# Altium schematic sheet 04 - Audio.SchDoc: Audio
size A4; DrawnBy: Trevor Charmley; DocumentNumber: 6; Revision: 1; SheetNumber: 6; SheetTotal: 8
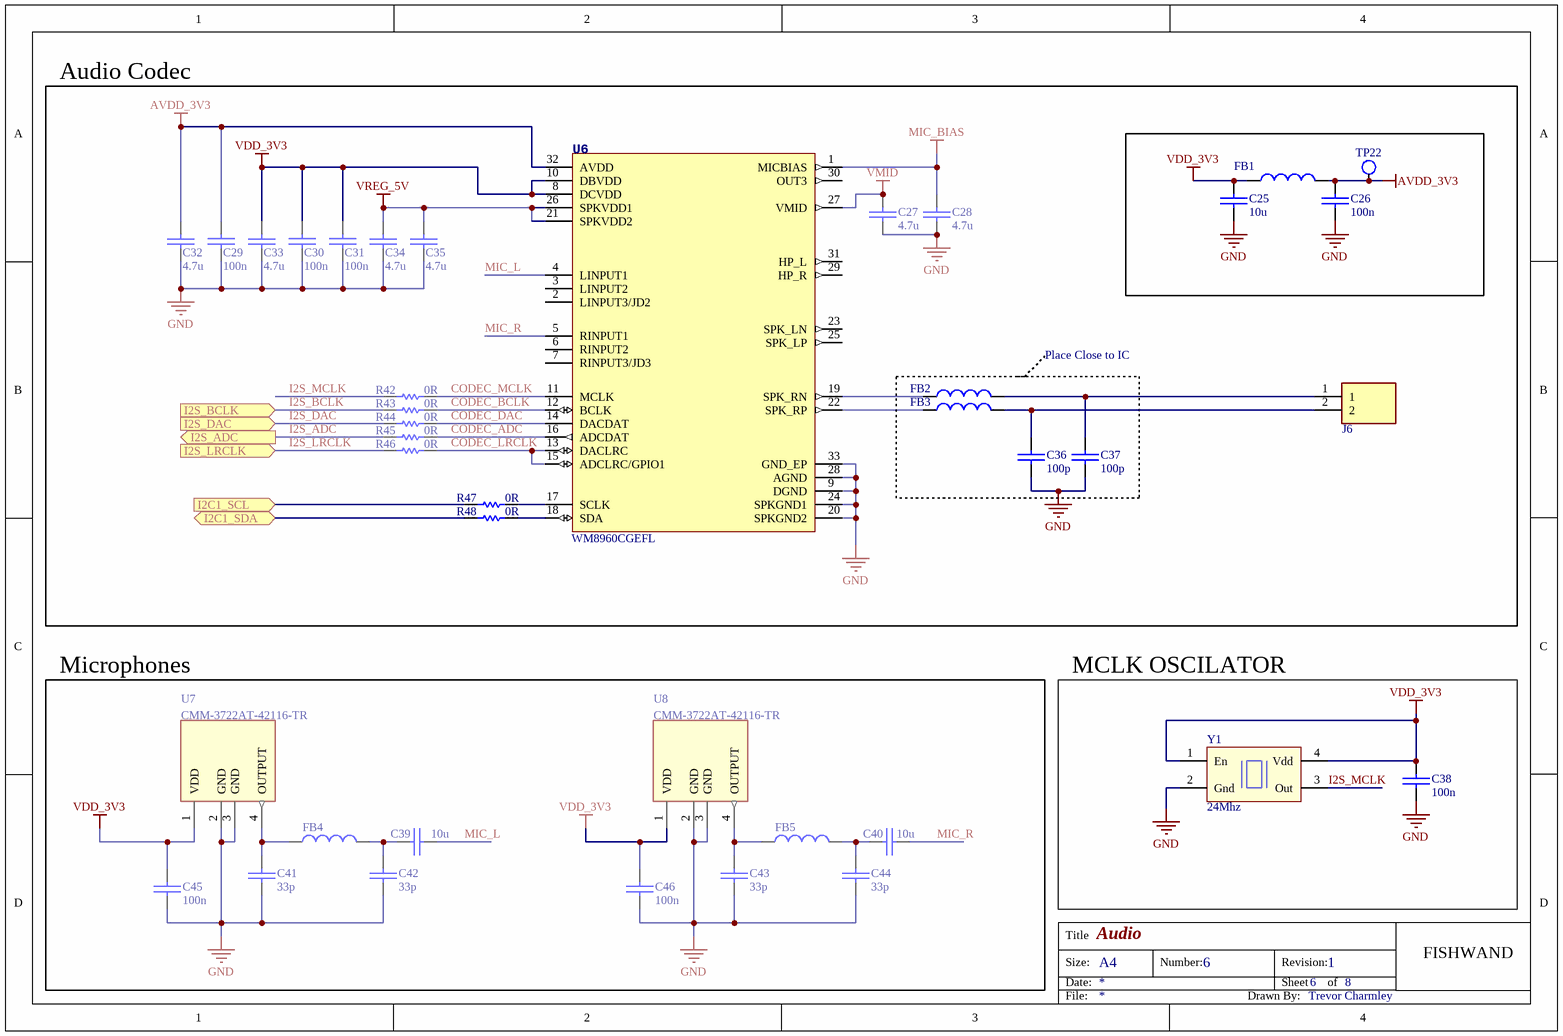
[diagram p0: 04 - Audio.SchDoc]

## Parts
C25  10u  [CAPC100X50X65]
C26  100n  [CAPC100X50X65]
C27  4.7u  [CAPC100X50X65]
C28  4.7u  [CAPC100X50X65]
C29  100n  [CAPC100X50X65]
C30  100n  [CAPC100X50X65]
C31  100n  [CAPC100X50X65]
C32  4.7u  [CAPC100X50X65]
C33  4.7u  [CAPC100X50X65]
C34  4.7u  [CAPC100X50X65]
C35  4.7u  [CAPC100X50X65]
C36  100p  [CAPC100X50X65]
C37  100p  [CAPC100X50X65]
C38  100n  [CAPC100X50X65]
C39  10u  [CAPC100X50X65]
C40  10u  [CAPC100X50X65]
C41  33p  [CAPC100X50X65]
C42  33p  [CAPC100X50X65]
C43  33p  [CAPC100X50X65]
C44  33p  [CAPC100X50X65]
C45  100n  [CAPC100X50X65]
C46  100n  [CAPC100X50X65]
FB1  BLM18RK121SN1D  [BEADC1608X95N]  (value not drawn)
FB2  BLM18RK121SN1D  [BEADC1608X95N]  (value not drawn)
FB3  BLM18RK121SN1D  [BEADC1608X95N]  (value not drawn)
FB4  BLM18BD252SN1D  [BEADC1608X95N]  (value not drawn)
FB5  BLM18BD252SN1D  [BEADC1608X95N]  (value not drawn)
J6  CONN_S2B-PH-K-S(LF)(SN)  [JST_S2B-PH-K-S(LF)(SN)]  (value not drawn)
R42  0R  [RESC0402]
R43  0R  [RESC0402]
R44  0R  [RESC0402]
R45  0R  [RESC0402]
R46  0R  [RESC0402]
R47  0R  [RESC0402]
R48  0R  [RESC0402]
TP22  Test Point  [tp_1mm]  (value not drawn)  (no BOM)
U6  WM8960CGEFL  [CIRRUS_LOGIC_WM8960CGEFL-V_0]
U7  CMM-3722AT-42116-TR  [XDCR_CMM-3722AT-42116-TR]
U8  CMM-3722AT-42116-TR  [XDCR_CMM-3722AT-42116-TR]
Y1  24Mhz  [OSC_SG-210STF 24.0000ML0]

## Blocks framed on the sheet
Audio Codec: C25-C35 FB1 J6 R42-R48 TP22 U6
Place Close to IC: C36 C37 FB2 FB3
Microphones: C39-C46 FB4 FB5 U7 U8
MCLK OSCILATOR: C38 Y1

## Ports
I2C1_SCL (in), I2C1_SDA (bidir), I2S_ADC (out), I2S_BCLK (in), I2S_DAC (in), I2S_LRCLK (in)

## Nets
AVDD_3V3: C26.1 C29.1 C32.2 FB1.2 TP22.1 U6.32(AVDD)
GND: C25.2 C26.2 C27.1 C28.1 C29.2 C30.2 C31.2 C32.1 C33.1 C34.1 C35.1 C36.2 C37.2 C38.2 C41.1 C42.1 C43.1 C44.1 C45.2 C46.2 U6.9(DGND) U6.20(SPKGND2) U6.24(SPKGND1) U6.28(AGND) U6.33(GND_EP) U7.2(GND) U7.3(GND) U8.2(GND) U8.3(GND) Y1.2(Gnd)
MIC_BIAS: C28.2 U6.1(MICBIAS)
VDD_3V3: C25.1 C30.1 C31.1 C33.2 C38.1 C45.1 C46.1 FB1.1 U6.8(DCVDD) U6.10(DBVDD) U7.1(VDD) U8.1(VDD) Y1.1(En) Y1.4(Vdd)
VMID: C27.2 U6.27(VMID)
VREG_5V: C34.2 C35.2 U6.21(SPKVDD2) U6.26(SPKVDD1)
CODEC_ADC: R45.2 U6.16(ADCDAT)
CODEC_BCLK: R43.2 U6.12(BCLK)
CODEC_DAC: R44.2 U6.14(DACDAT)
CODEC_LRCLK: R46.2 U6.13(DACLRC) U6.15(ADCLRC/GPIO1)
CODEC_MCLK: R42.2 U6.11(MCLK)
I2C1_SCL: R47.1 ; port I2C1_SCL
I2C1_SDA: R48.1 ; port I2C1_SDA
I2S_ADC: R45.1 ; port I2S_ADC
I2S_BCLK: R43.1 ; port I2S_BCLK
I2S_DAC: R44.1 ; port I2S_DAC
I2S_LRCLK: R46.1 ; port I2S_LRCLK
I2S_MCLK: R42.1 Y1.3(Out)
MIC_L: C39.2 U6.4(LINPUT1)
MIC_R: C40.2 U6.5(RINPUT1)
NetC36_1: C36.1 FB3.2 J6.2
NetC37_1: C37.1 FB2.2 J6.1
NetC39_1: C39.1 C42.2 FB4.2
NetC40_1: C40.1 C44.2 FB5.2
NetC41_2: C41.2 FB4.1 U7.4(OUTPUT)
NetC43_2: C43.2 FB5.1 U8.4(OUTPUT)
NetFB2_1: FB2.1 U6.19(SPK_RN)
NetFB3_1: FB3.1 U6.22(SPK_RP)
NetR47_2: R47.2 U6.17(SCLK)
NetR48_2: R48.2 U6.18(SDA)

Not connected (* = marked no-connect by the designer): U6 2(LINPUT3/JD2) 3(LINPUT2) 6(RINPUT2) 7(RINPUT3/JD3) 23(SPK_LN) 25(SPK_LP) 29(HP_R) 30(OUT3) 31(HP_L)

## Notes on the sheet
- Title
- Size:
- Date:
- A4
- Number:
- Revision:
- Sheet
- of
- FISHWAND
- File:
- Drawn By:

## Library data of the parts
C25 C39 C40 = C_10UF_10V_X5R_0402: CAP CER 10UF 10V X5R 0402; Manufacturer: Samsung Electro-Mechanics; Manufacturer PN: CL05A106MP5NUNC; Supplier PN: 1276-1450-1-ND
C26 C29-C31 C38 C45 C46 = C_100NF_25V_X5R_0402: CAP CER 100nF 25V X5R 0402; Manufacturer: Murata Electronics; Manufacturer PN: GRM155R61E104KA87D; Supplier: Digi-Key; Supplier PN: 490-5920-2-ND
C27 C28 C32-C35 = C_4.7UF_10V_X5R_0402: CAP CER 4.7UF 10V X5R 0402; Manufacturer: Murata Electronics North America; Manufacturer PN: GRM155R61A475MEAAD; Supplier PN: 490-14306-1-ND
C36 C37 = C_100PF_50V_C0G/NP0_0402: CAP CER 100PF 50V C0G/NP0 0402; Manufacturer: Murata Electronics; Manufacturer PN: GRT1555C1H101JA02J; Supplier: Digi-Key; Supplier PN: 490-GRT1555C1H101JA02JTR-ND
C41-C44 = C_33PF_50V_X5R_0402: CAP CER 33PF 50V C0G/NP0 0402; Manufacturer: Murata Electronics; Manufacturer PN: GRM1555C1H330JA01D; Supplier: Digi-Key; Supplier PN: 490-5936-2-ND
FB1-FB3 = FB_0603_120_100MHz: 120 Ohms @ 100 MHz 1 Ferrite Bead 0603 (1608 Metric) 200mA 250mOhm; Manufacturer: Murata Electronics; Value: 120@100MHz; Manufacturer PN: BLM18RK121SN1D; Supplier: Digi-Key; Supplier PN: 490-5226-1-ND; Package / Case: 0603; Current: 200mA; test: *
FB4 FB5 = FB_0603_2.5K_100MHz: 2.5 kOhms @ 100 MHz 1 Signal Line Ferrite Bead 0603 (1608 Metric) 50mA 1.5Ohm; Manufacturer: Murata Electronics; Value: 2.5k@100MHz; Manufacturer PN: BLM18BD252SN1D; Supplier: *; Supplier PN: *; Package / Case: 0603
J6 = CONN_S2B-PH-K-S(LF)(SN): CONN PH Series 2 Position 2.0 mm Through Hole Side Entry Shrouded Header; Manufacturer: JST; Availability: Unavailable; Value: *; Manufacturer PN: S2B-PH-K-S(LF)(SN); Price: None; Package / Case: None
R42-R48 = R_0402_0R_5%: 0 Ohms Jumper 0.063W, 1/16W Chip Resistor 0402 (1005 Metric) Thick Film; Manufacturer: YAGEO; Manufacturer PN: RC0402JR-070RP; Tolerance: 5%; Supplier: *; Supplier PN: *; Value: 0R; Package / Case: 0402
TP22 = TP_1mm
U6 = CIRRUS_LOGIC_U_WM8960CGEFL-VCIRRUS_LOGIC_WM8960CGEFL-V_0_0: Manufacturer: Cirrus Logic; Manufacturer PN: WM8960CGEFL/V; Package / Case: QFN32
U7 U8 = CMM-3722AT-42116-TR: MICROPHONE MEMS ANALOG OMNI; Manufacturer: CUI Devices; Price: 1.33; Value: *; Availability: Unavailable; Package / Case: SMD/SMT; Manufacturer PN: CMM-3722AT-42116-TR; Supplier: Mouser; Supplier PN: 490-CMM3722AT42116TR
Y1 = Y_24Mhz_Crystal_SG-210STF 24.0000ML0: 24 MHz XO (Standard) CMOS Oscillator 1.6V ~ 3.6V Standby (Power Down) 4-SMD, No Lead; Manufacturer: EPSON; Value: *; Manufacturer PN: SG-210STF 24.0000ML0; Price: None; Supplier: Digi-Key; Supplier PN: SER4078TR-ND; Package / Case: 4-SMD, No Lead